# EAGLE design thar_board_general_mk1 (EAGLE 9.6.2)
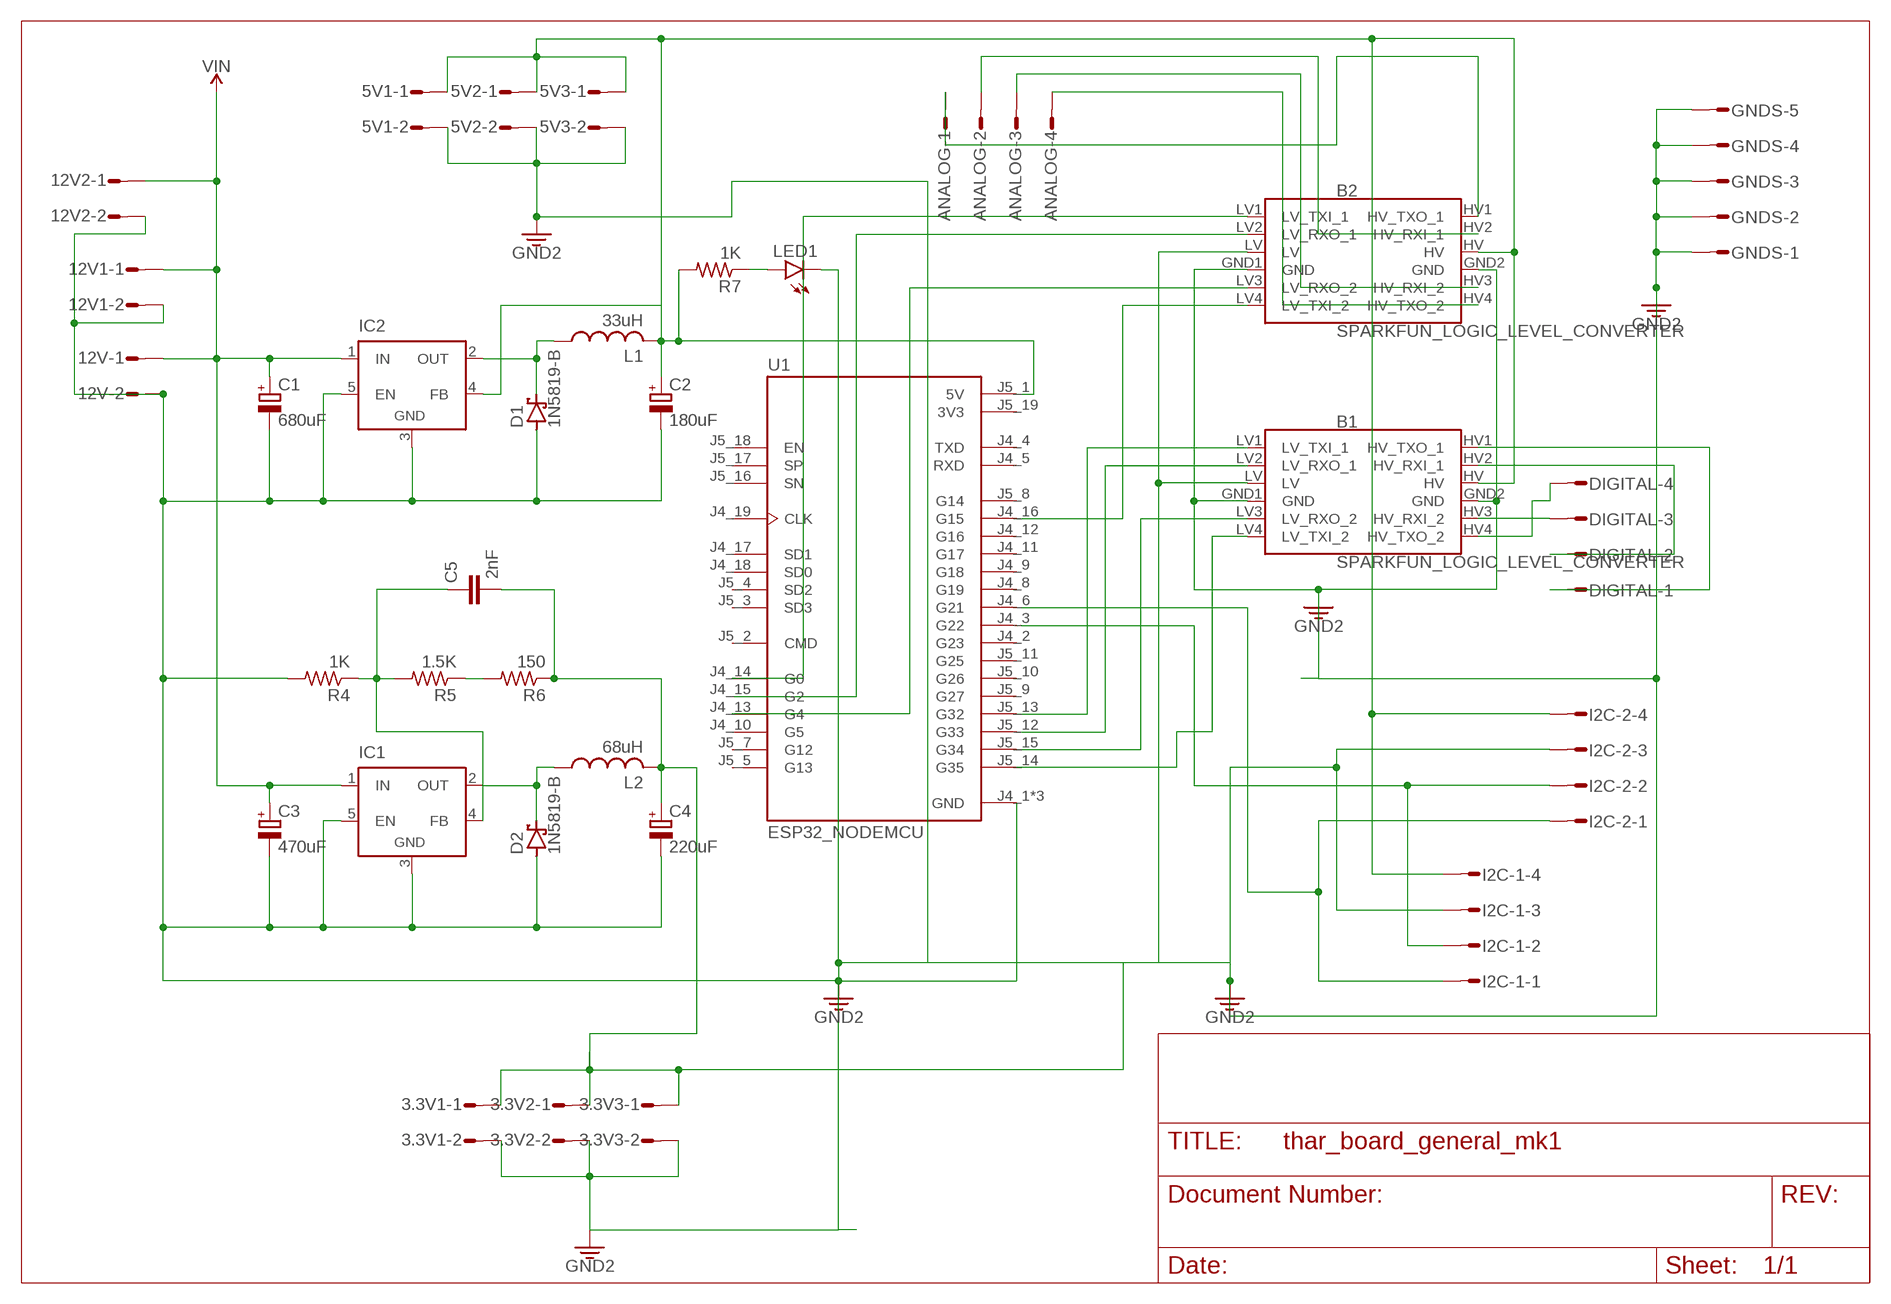
[diagram p0: schematic, sheet 1]

## Parts
3.3V1  L02P  [L02P]
3.3V2  L02P  [L02P]
3.3V3  L02P  [L02P]
5V1  L02P  [L02P]
5V2  L02P  [L02P]
5V3  L02P  [L02P]
12V  L02P  [L02P]
12V1  L02P  [L02P]
12V2  L02P  [L02P]
ANALOG  L04P  [L04P]
B1  SPARKFUN_LOGIC_LEVEL_CONVERTER  [SPARKFUN_LOGIC_LEVEL_CONVERTER]
B2  SPARKFUN_LOGIC_LEVEL_CONVERTER  [SPARKFUN_LOGIC_LEVEL_CONVERTER]
C1  680uF  CPOL-EUE2.5-7  [E2,5-7]
C2  180uF  CPOL-EUE2.5-7  [E2,5-7]
C3  470uF  CPOL-EUE2.5-7  [E2,5-7]
C4  220uF  CPOL-EUE2.5-7  [E2,5-7]
C5  2nF  C-EU025-025X050  [C025-025X050]
D1  1N5819-B  [DO41-7.6]
D2  1N5819-B  [DO41-7.6]
DIGITAL  L04P  [L04P]
GNDS  L05P  [L05P]
I2C-1  L04P  [L04P]
I2C-2  L04P  [L04P]
IC1  LM2596TH  [TO220-52]
IC2  LM2596TH  [TO220-52]
L1  33uH  L-USTFI0410  [TFI0410]
L2  68uH  L-USTFI0410  [TFI0410]
LED1  LED3MM  [LED3MM]
R4  1K  R-US_0207/10  [0207/10]
R5  1.5K  R-US_0207/10  [0207/10]
R6  150  R-US_0207/10  [0207/10]
R7  1K  R-US_0207/10  [0207/10]
U1  ESP32_NODEMCU  [MODULE_ESP32_NODEMCU]

## Nets
5V: 5V1.1 5V2.1 5V3.1 B1.HV B2.HV C2.+ I2C-1.4 I2C-2.4 IC2.4(FB) L1.2 R7.2 U1.J5_1(5V)
5V1: 3.3V1.1 3.3V2.1 3.3V3.1 B1.LV B2.LV C4.+ C5.2 L2.2 R6.1
DLETE: B2.LV1(LV_TXI_1) U1.J4_14(G0)
GND: 3.3V1.2 3.3V2.2 3.3V3.2 5V1.2 5V2.2 5V3.2 12V1.2 12V2.2 12V.2 B1.GND1(GND) B1.GND2(GND) B2.GND1(GND) B2.GND2(GND) C1.- C2.- C3.- C4.- D1.A D2.A GNDS.1 GNDS.2 GNDS.3 GNDS.4 GNDS.5 I2C-1.3 I2C-2.3 IC1.3(GND) IC1.5(EN) IC2.3(GND) IC2.5(EN) LED1.K(C) R4.2 U1.J4_1(GND) U1.J4_7(GND) U1.J5_6(GND) ; supply symbol labelled GND2
N$1: LED1.A R7.1
N$2: B2.LV4(LV_TXI_2) U1.J4_16(G15)
N$3: B1.HV1(HV_TXO_1) DIGITAL.1
N$4: B2.LV2(LV_RXO_1) U1.J4_15(G2)
N$5: D1.C IC2.2(OUT) L1.1
N$6: B2.LV3(LV_RXO_2) U1.J4_13(G4)
N$7: ANALOG.1 B2.HV1(HV_TXO_1)
N$8: D2.C IC1.2(OUT) L2.1
N$9: ANALOG.4 B2.HV4(HV_TXO_2)
N$10: ANALOG.3 B2.HV3(HV_RXI_2)
N$11: ANALOG.2 B2.HV2(HV_RXI_1)
N$12: B1.LV1(LV_TXI_1) U1.J5_13(G32)
N$13: C5.1 IC1.4(FB) R4.1 R5.2
N$14: B1.LV2(LV_RXO_1) U1.J5_12(G33)
N$15: R5.1 R6.2
N$16: B1.LV3(LV_RXO_2) U1.J5_15(G34)
N$17: B1.LV4(LV_TXI_2) U1.J5_14(G35)
N$18: B1.HV2(HV_RXI_1) DIGITAL.2
N$19: B1.HV3(HV_RXI_2) DIGITAL.3
N$20: B1.HV4(HV_TXO_2) DIGITAL.4
SCL: I2C-1.2 I2C-2.2 U1.J4_3(G22)
SDA: I2C-1.1 I2C-2.1 U1.J4_6(G21)
VIN: 12V1.1 12V2.1 12V.1 C1.+ C3.+ IC1.1(IN) IC2.1(IN)
Unconnected: U1.J4_2(G23) U1.J4_4(TXD) U1.J4_5(RXD) U1.J4_8(G19) U1.J4_9(G18) U1.J4_10(G5) U1.J4_11(G17) U1.J4_12(G16) U1.J4_17(SD1) U1.J4_18(SD0) U1.J4_19(CLK) U1.J5_2(CMD) U1.J5_3(SD3) U1.J5_4(SD2) U1.J5_5(G13) U1.J5_7(G12) U1.J5_8(G14) U1.J5_9(G27) U1.J5_10(G26) U1.J5_11(G25) U1.J5_16(SN) U1.J5_17(SP) U1.J5_18(EN)

## Power pins joined to a net without a drawn wire
3V3: U1.J5_19(3V3)

## Library data of the parts
3.3V1-3.3V3 5V1-5V3 12V 12V1 12V2 = con-amp-mt:L02P: AMP MT CONNECTOR; OC_FARNELL: unknown; OC_NEWARK: unknown
ANALOG DIGITAL I2C-1 I2C-2 = con-amp-mt:L04P: AMP MT CONNECTOR; OC_FARNELL: unknown; OC_NEWARK: unknown
B1 B2 = SparkFun-Boards:SPARKFUN_LOGIC_LEVEL_CONVERTER: SparkFun Logic Level Converter -Bi-Directional This is the mechnical outline for the 3.3V - 5V bi directional logic level converter. *Note, the "LOCK" Package has the header pins staggered by an offset of 5 mils (off center line), so that when you slide a row of standard 0.1" headers into the PTH pads, it will hold position vertically. See the follwing turorial for more information on this type of special footprints: Sneaky Footprints <https://www.sparkfun.com/tutorials/114> SparkFun Products: SparkFun Logic Level Converter - Bi-Directional <https://www.sparkfun.com/products/12009>
C1-C4 = rcl:CPOL-EU: POLARIZED CAPACITOR, European symbol; SPICEPREFIX: C
C5 = rcl:C-EU: CAPACITOR, European symbol; SPICEPREFIX: C
D1 D2 = diode:1N581*: 1.0A SCHOTTKY BARRIER RECTIFIER Source: http://www.diodes.com/datasheets/ds23001.pdf
GNDS = con-amp-mt:L05P: AMP MT CONNECTOR; OC_FARNELL: unknown; OC_NEWARK: unknown
IC1 IC2 = linear:LM2596T: STEP-DOWN VOLTAGE REGULATOR
L1 L2 = rcl:L-US: INDUCTOR, American symbol; SPICEPREFIX: L
LED1 = led:LED: LED OSRAM: - CHIPLED LG R971, LG N971, LY N971, LG Q971, LY Q971, LO R971, LY R971 LH N974, LH R974 LS Q976, LO Q976, LY Q976 LO Q996 - Hyper CHIPLED LW Q18S LB Q993, LB Q99A, LB R99A - SideLED LS A670, LO A670, LY A670, LG A670, LP A670 LB A673, LV A673, LT A673, LW A673 LH A674 LY A675 LS A676, LA A676, LO A676, LY A676, LW A676 LS A679, LY A679, LG A679 - Hyper Micro SIDELED® LS Y876, LA Y876, LO Y876, LY Y876 LT Y87S - SmartLED LW L88C, LW L88S LB L89C, LB L89S, LG L890 LS L89K, LO L89K, LY L89K LS L896, LA L896, LO L896, LY L896 - TOPLED LS T670, LO T670, LY T670, LG T670, LP T670 LSG T670, LSP T670, LSY T670, LOP T670, LYG T670 LG T671, LOG T671, LSG T671 LB T673, LV T673, LT T673, LW T673 LH T674 LS T676, LA T676, LO T676, LY T676, LB T676, LH T676, LSB T676, LW T676 LB T67C, LV T67C, LT T67C, LS T67K, LO T67K, LY T67K, LW E67C LS E67B, LA E67B, LO E67B, LY E67B, LB E67C, LV E67C, LT E67C LW T67C LS T679, LY T679, LG T679 LS T770, LO T770, LY T770, LG T770, LP T770 LB T773, LV T773, LT T773, LW T773 LH T774 LS E675, LA E675, LY E675, LS T675 LS T776, LA T776, LO T776, LY T776, LB T776 LHGB T686 LT T68C, LB T68C - Hyper Mini TOPLED® LB M676 - Mini TOPLED Santana® LG M470 LS M47K, LO M47K, LY M47K Source: http://www.osram.convergy.de LUXEON: - LUMILED® LXK2-PW12-R00, LXK2-PW12-S00, LXK2-PW14-U00, LXK2-PW14-V00 LXK2-PM12-R00, LXK2-PM12-S00, LXK2-PM14-U00 LXK2-PE12-Q00, LXK2-PE12-R00, LXK2-PE12-S00, LXK2-PE14-T00, LXK2-PE14-U00 LXK2-PB12-K00, LXK2-PB12-L00, LXK2-PB12-M00, LXK2-PB14-N00, LXK2-PB14-P00, LXK2-PB14-Q00 LXK2-PR12-L00, LXK2-PR12-M00, LXK2-PR14-Q00, LXK2-PR14-R00 LXK2-PD12-Q00, LXK2-PD12-R00, LXK2-PD12-S00 LXK2-PH12-R00, LXK2-PH12-S00 LXK2-PL12-P00, LXK2-PL12-Q00, LXK2-PL12-R00 Source: www.luxeon.com KINGBRIGHT: KA-3528ASYC Source: www.kingbright.com
R4-R7 = rcl:R-US_: RESISTOR, American symbol; SPICEPREFIX: R
U1 = ESP32_NODEMCU:ESP32_NODEMCU: Check availability <https://pricing.snapeda.com/parts/ESP32%20NodeMCU/Espressif%20Systems/view-part?ref=eda>; AVAILABILITY: Not in stock; DESCRIPTION: NodeMCU is an open source loT platform. ESP32 is a series of low cost, low power system-on-chip (SoC) microcontrollers with integrated Wi-Fi & dual-mode Bluetooth.; MF: Espressif Systems; MP: ESP32 NodeMCU; PACKAGE: Package; PRICE: None

## Board
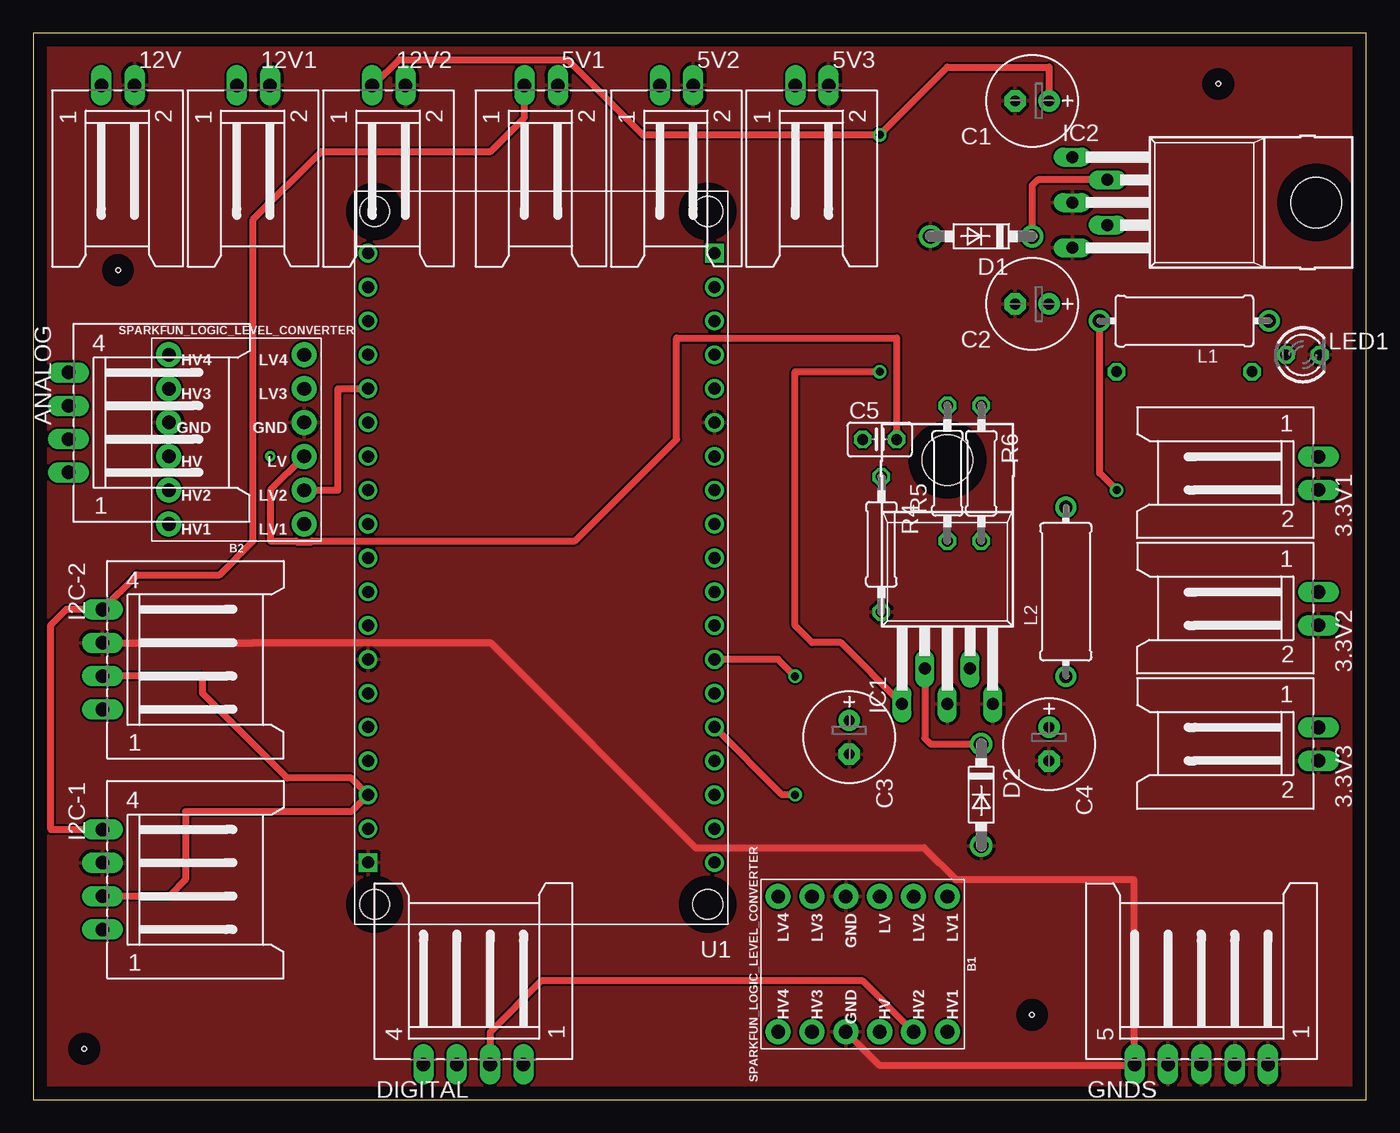
[diagram p1: board, top side]
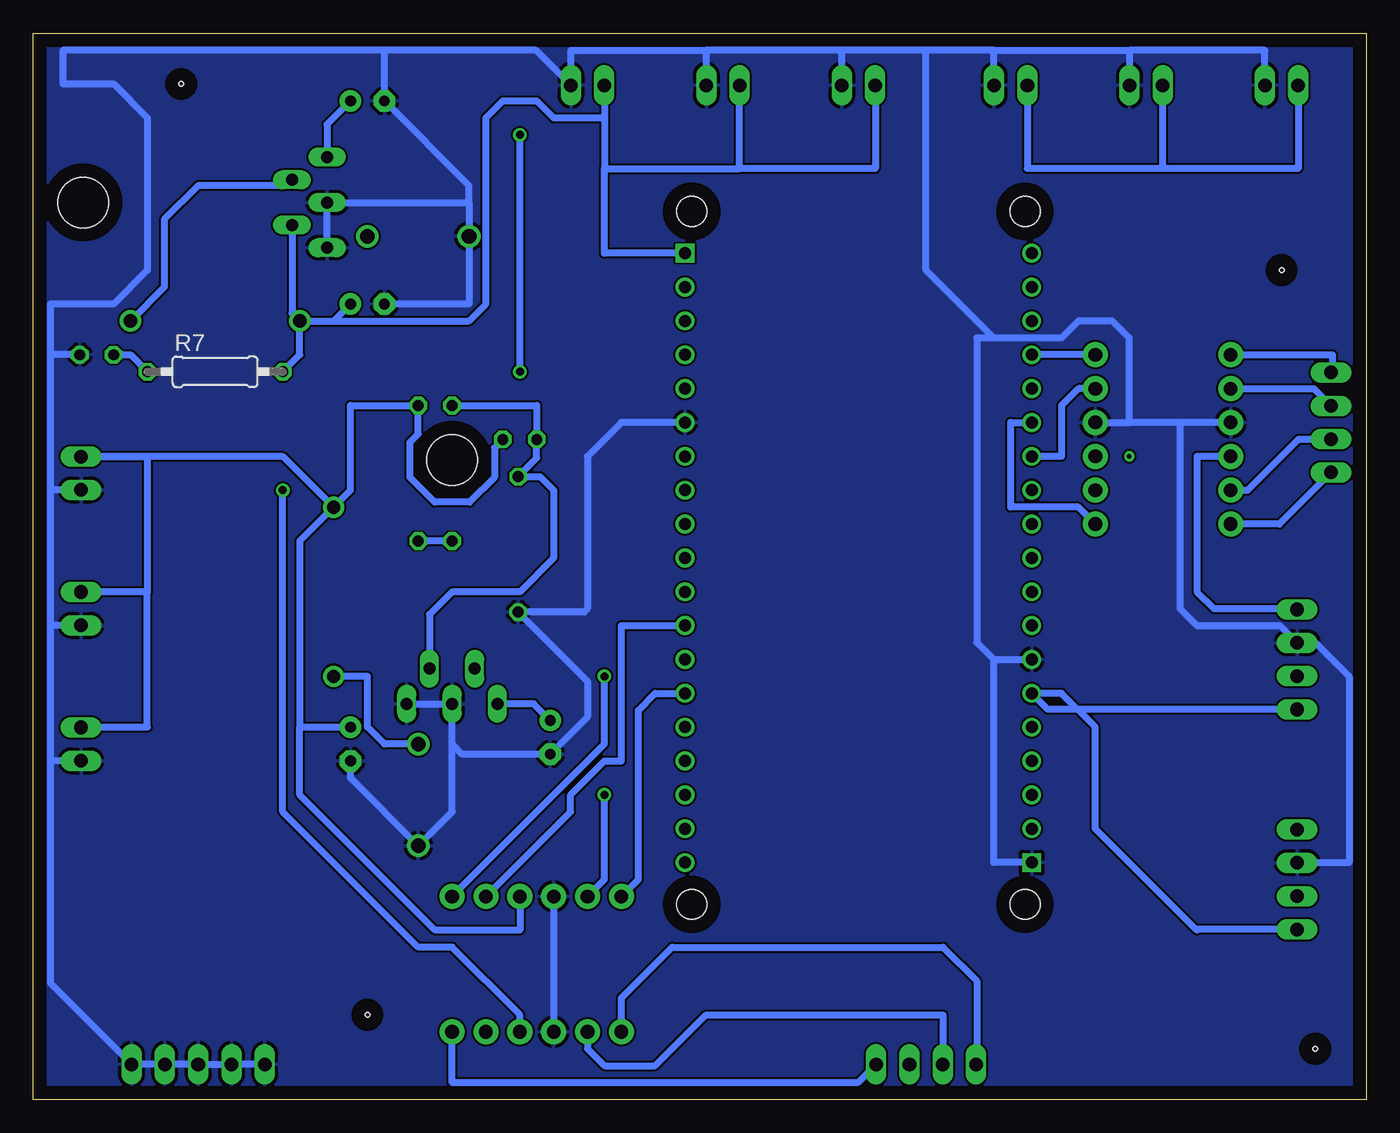
[diagram p2: board, bottom side, seen from below]

Size 100 x 80 mm. Coordinates in mm from the lower left corner, seen from the top.
Outline: 0,0 100,0 100,80 0,80 0,0
Copper layers (1*16): Top 0.035mm / dielectric 1.5mm / Bottom 0.035mm
Design rules "default": minimum track width 6mil, minimum drill 0.35mm, track to track 6mil, track to pad 6mil, pad to pad 6mil, via to via 6mil, smd to smd 6mil, copper to edge 40mil, drill to drill 6mil, minimum pad ring 10mil, minimum via ring 8mil, stop-mask expansion 4mil, vias tented up to drill 0mil, thermal gap 10mil
Holes 0.35 mm at 3.81,3.81 74.93,6.35 88.9,76.2 6.35,62.23

### Footprints (pad centres in the part's own frame; a part is rotated, then mirrored left to right if it is on the bottom)
L02P = drill 1.016 long: 1 1.25,-6.25; 2 -1.25,-6.25
L04P = drill 1.016 long: 1 3.75,-6.25; 2 1.25,-6.25; 3 -1.25,-6.25; 4 -3.75,-6.25
SPARKFUN_LOGIC_LEVEL_CONVERTER = drill 1.016 pad 1.88: GND1 -5.08,-1.27; GND2 5.08,-1.27; HV 5.08,1.27; HV1 5.08,6.35; HV2 5.08,3.81; HV3 5.08,-3.81; HV4 5.08,-6.35; LV -5.08,1.27; LV1 -5.08,6.35; LV2 -5.08,3.81; LV3 -5.08,-3.81; LV4 -5.08,-6.35
E2,5-7 = drill 0.813 pad 1.6: + -1.27,0 | drill 0.813 pad 1.6 octagon: - 1.27,0
C025-025X050 = drill 0.813 octagon: 1 -1.27,0; 2 1.27,0
DO41-7.6 = drill 1.1 pad 1.7: A 3.81,0; C -3.81,0
L05P = drill 1.016 long: 1 5,-6.25; 2 2.5,-6.25; 3 0,-6.25; 4 -2.5,-6.25; 5 -5,-6.25
TO220-52 = drill 0.9 long: 1 -3.4,-21.1; 2 -1.7,-18.47; 3 0,-21.1; 4 1.7,-18.47; 5 3.4,-21.1 | hole 3.8: 0,-2.8
TFI0410 = drill 1 pad 1.6: 1 -6.35,0; 2 6.35,0
LED3MM = drill 0.813 octagon: A -1.27,0; K 1.27,0
0207/10 = drill 0.813 octagon: 1 -5.08,0; 2 5.08,0
MODULE_ESP32_NODEMCU = drill 0.9 pad 1.35 square: J4_1 13,22.86; J5_1 -13,-22.86 | drill 0.9 pad 1.35: J4_2 13,20.32; J4_3 13,17.78; J4_4 13,15.24; J4_5 13,12.7; J4_6 13,10.16; J4_7 13,7.62; J4_8 13,5.08; J4_9 13,2.54; J4_10 13,0; J4_11 13,-2.54; J4_12 13,-5.08; J4_13 13,-7.62; J4_14 13,-10.16; J4_15 13,-12.7; J4_16 13,-15.24; J4_17 13,-17.78; J4_18 13,-20.32; J4_19 13,-22.86; J5_2 -13,-20.32; J5_3 -13,-17.78; J5_4 -13,-15.24; J5_5 -13,-12.7; J5_6 -13,-10.16; J5_7 -13,-7.62; J5_8 -13,-5.08; J5_9 -13,-2.54; J5_10 -13,0; J5_11 -13,2.54; J5_12 -13,5.08; J5_13 -13,7.62; J5_14 -13,10.16; J5_15 -13,12.7; J5_16 -13,15.24; J5_17 -13,17.78; J5_18 -13,20.32; J5_19 -13,22.86 | hole 2.25: -12.5,-26; 12.5,-26; -12.5,26; 12.5,26

### Placement (x,y rotation side)
3.3V1  90.17,46.99 90 top
3.3V2  90.17,36.83 90 top
3.3V3  90.17,26.67 90 top
5V1  38.1,69.85 180 top
5V2  48.26,69.85 180 top
5V3  58.42,69.85 180 top
12V  6.35,69.85 180 top
12V1  16.51,69.85 180 top
12V2  26.67,69.85 180 top
ANALOG  8.89,50.8 270 top
B1  62.23,10.16 270 top
B2  15.24,49.53 180 top
C1  74.93,74.93 180 top
C2  74.93,59.69 180 top
C3  61.21,27.18 270 top
C4  76.2,26.67 270 top
C5  63.5,49.53 0 top
D1  71.12,64.77 180 top
D2  71.12,22.86 270 top
DIGITAL  33.02,8.89 0 top
GNDS  87.63,8.89 0 top
I2C-1  11.43,16.51 270 top
I2C-2  11.43,33.02 270 top
IC1  68.58,50.8 0 top
IC2  99.06,67.31 270 top
L1  86.36,58.42 180 top
L2  77.47,38.1 90 top
LED1  95.25,55.88 0 top
R4  63.63,41.66 270 top
R5  68.58,46.99 90 top
R6  71.12,46.99 270 top
R7  86.36,54.61 0 bottom
U1  38.1,40.64 180 top

### Tracks (layer width: path | path; a pad name or v marks a point on that pad's centre or on a via)
5V  (via drill 0.6)
  Top 0.508: 5V1.1 36.85,73.68 34.29,71.12 21.59,71.12 16.51,66.04 16.51,41.91 13.97,39.37 7.78,39.37 I2C-2.4 2.48,36.77 1.27,35.56 1.27,20.32 1.33,20.26 I2C-1.4 | v81.28,45.72 80.01,46.99 L1.2
  Bottom 0.508: 5V1.1 36.83,76.1 36.83,69.85 47.01,69.85 | 47.01,69.85 5V2.1 | 5V3.1 57.15,76.1 57.15,73.66 | 57.15,73.66 57.15,69.85 | 57.15,69.85 47.01,69.85 | B1.HV 63.5,6.35 68.58,11.43 71.12,11.43 81.28,21.59 v81.28,45.72 | R7.2 80.01,55.88 L1.2 | L1.2 77.47,58.42 C2.+ | IC2.4 80.59,59 L1.2 | L1.2 67.31,58.42 66.04,59.69 66.04,73.66 64.77,74.93 62.23,74.93 60.96,73.66 57.15,73.66 | U1.J5_1 57.15,63.5 57.15,69.85 | B2.HV 12.7,48.26 12.7,38.1 11.43,36.83 5.24,36.83 I2C-2.4
5V1
  Top 0.508: B2.LV 17.78,45.72 17.78,41.91 19.69,41.91 19.76,41.83 20.88,41.83 20.95,41.91 40.64,41.91 48.26,49.53 48.26,57.15 64.77,57.15 C5.2
  Bottom 0.508: 91.44,38.08 3.3V2.1 | 91.44,38.08 91.44,48.26 96.42,48.26 3.3V1.1 81.26,48.24 L2.2 | 3.3V3.1 96.42,27.94 91.44,27.94 91.44,38.08 | L2.2 80.01,41.91 80.01,27.94 | 80.01,27.94 C4.+ | L2.2 76.2,45.72 76.2,52.07 R6.1 71.12,49.94 71.75,49.31 71.75,46.69 69.89,44.83 67.27,44.83 65.41,46.69 65.41,48.89 C5.2 | B1.LV 63.5,12.7 69.85,12.7 80.01,22.86 80.01,27.94
DLETE
  Bottom 0.508: B2.LV1 21.59,44.45 26.67,44.45 26.67,50.8 U1.J4_14
GND
  Top 0.508: B1.GND2 63.5,2.54 82.53,2.54 82.55,2.56 82.55,16.51 69.21,16.51 66.83,18.89 49.69,18.89 34.29,34.29 16.51,34.29 16.49,34.27 I2C-2.3
  Bottom 0.508: B1.GND1 B1.GND2 | B2.GND1 17.78,50.8 | GNDS.5 GNDS.4 GNDS.3 GNDS.2 GNDS.1 98.73,8.74 98.73,25.4 | 3.3V2.2 98.73,35.58 | 3.3V3.2 96.42,25.4 98.73,25.4 | 98.73,35.58 98.73,25.4 | 3.3V1.2 97.79,45.74 97.79,45.72 98.73,45.72 | 98.73,45.72 98.73,35.58 | 5V1.2 39.35,78.73 | 39.35,78.73 49.53,78.73 | 49.53,78.73 49.53,76.1 5V2.2 | 59.67,78.73 5V3.2 62.3,78.73 73.66,78.73 | 59.69,78.73 59.67,78.73 | 59.67,78.73 49.53,78.73 | 12V.2 7.6,78.73 17.78,78.73 | 12V1.2 17.78,76.1 17.78,78.73 | 12V2.2 27.92,78.73 | 27.92,78.73 17.78,78.73 | 27.92,78.73 33.02,78.73 | 33.02,78.73 39.35,78.73 | 73.66,78.73 97.79,78.73 97.79,76.2 93.98,76.2 91.44,73.66 91.44,62.23 93.98,59.69 98.73,59.69 98.73,55.88 | 98.73,55.88 98.73,45.72 | I2C-1.3 1.29,17.76 1.27,17.78 1.27,31.75 3.79,34.27 I2C-2.3 6.47,35.56 12.7,35.56 13.97,36.83 13.97,50.8 | U1.J4_1 27.94,17.78 27.94,33.02 | 27.94,33.02 U1.J4_7 | 27.94,57.15 22.86,57.15 21.59,58.42 19.05,58.42 17.78,57.15 17.78,50.8 | 27.94,57.15 29.21,57.15 29.21,34.29 27.94,33.02 | 27.94,57.15 33.02,62.23 33.02,78.73 | U1.J5_6 55.88,50.8 58.42,48.26 58.42,36.83 58.67,36.58 R4.2 58.42,31.37 58.42,28.7 C3.- 67.82,25.91 68.58,26.67 | 68.58,26.67 IC1.3 IC1.5 | 68.58,26.67 68.58,21.59 D2.A 76.2,24.13 C4.- | LED1.K 98.73,55.88 | 67.31,67.31 IC2.3 IC2.5 | 67.31,67.31 D1.A 67.31,59.69 C2.- | 67.31,67.31 67.31,68.58 C1.- 73.66,78.73 | B2.GND2 13.97,50.8 | 13.97,50.8 17.78,50.8
  pour Bottom: 0,80.01 100.33,80.01 100.33,0 99.06,0 0,0
  pour Top: 0,80.01 100.33,80.01 100.33,0 99.06,0 0,0 0,10.16
N$1
  Bottom 0.508: LED1.A 92.71,55.88 R7.1
N$2
  Bottom 0.508: B2.LV4 U1.J4_16 25.4,55.88
N$3
  Bottom 0.508: DIGITAL.1 38.14,1.27 68.58,1.27 B1.HV1
N$4
  Top 0.508: B2.LV2 22.86,45.72 22.86,53.34 U1.J4_15
N$5
  Top 0.508: IC2.2 75.36,69.01 74.93,68.58 D1.C
  Bottom 0.508: IC2.2 81.02,68.58 87.63,68.58 90.17,66.04 90.17,60.96 L1.1
N$6
  Bottom 0.508: B2.LV3 21.59,53.34 22.86,52.07 22.86,48.26 U1.J4_13 25.4,48.26
N$7
  Bottom 0.508: ANALOG.1 6.51,43.18 B2.HV1
N$8
  Top 0.508: IC1.2 66.88,27.1 67.31,26.67 D2.C
  Bottom 0.508: D2.C 73.66,26.67 74.93,27.94 74.93,31.75 L2.1
N$9
  Bottom 0.508: B2.HV4 2.54,55.88 2.54,54.55 ANALOG.4
N$10
  Bottom 0.508: ANALOG.3 3.93,53.34 B2.HV3
N$11
  Bottom 0.508: B2.HV2 8.89,45.72 5.06,49.55 ANALOG.2
N$12  (via drill 0.6)
  Top 0.508: v57.15,31.75 55.88,33.02 U1.J5_13
  Bottom 0.508: B1.LV1 57.15,26.67 v57.15,31.75
N$13
  Bottom 0.508: R5.2 62.23,52.07 C5.1 62.23,48.13 R4.1 61.98,46.74 60.96,45.72 60.96,40.64 63.5,38.1 68.58,38.1 70.28,36.4 IC1.4
N$14
  Bottom 0.508: B1.LV2 59.69,21.59 59.69,22.86 57.15,25.4 55.88,25.4 55.88,35.56 U1.J5_12
N$15
  Bottom 0.508: R5.1 R6.2
N$16  (via drill 0.6)
  Top 0.508: v57.15,22.86 56.18,22.86 U1.J5_15
  Bottom 0.508: B1.LV3 57.15,16.51 v57.15,22.86
N$17
  Bottom 0.508: B1.LV4 54.61,16.51 54.61,29.21 53.34,30.48 U1.J5_14
N$18
  Top 0.508: B1.HV2 62.23,8.89 38.1,8.89 34.27,5.06 DIGITAL.2
N$19
  Bottom 0.508: B1.HV3 58.42,3.81 57.15,2.54 53.34,2.54 49.53,6.35 31.75,6.35 31.75,2.66 DIGITAL.3
N$20
  Bottom 0.508: B1.HV4 55.88,7.62 52.07,11.43 31.75,11.43 29.21,8.89 29.21,2.7 DIGITAL.4
N$21  (via drill 0.35)
  other vias: 17.78,48.26
SCL
  Top 0.508: I2C-1.2 10.18,15.26 11.43,16.51 11.43,21.59 23.83,21.59 U1.J4_3 23.83,24.13 19.05,24.13 12.7,30.48 12.7,31.75 12.68,31.77 I2C-2.2
SDA
  Bottom 0.508: I2C-2.1 23.89,29.27 U1.J4_6 22.86,30.48 20.32,27.94 20.32,20.32 12.7,12.7 12.64,12.76 I2C-1.1
VIN  (via drill 0.6)
  Top 0.508: 12V2.1 25.51,76.1 27.44,78.03 40.08,78.03 45.72,72.39 v63.5,72.39 68.58,77.47 76.2,77.47 C1.+ | IC1.1 60.59,34.29 58.42,34.29 57.15,35.56 57.15,54.61 v63.5,54.61
  Bottom 0.508: 12V.1 5.1,69.85 15.26,69.85 | 15.26,69.85 12V1.1 | 12V2.1 25.42,69.85 15.26,69.85 | C3.+ 62.47,29.7 IC1.1 | C1.+ 77.96,73.17 IC2.1 | v63.5,54.61 v63.5,72.39